# Altium schematic sheet Debug.SchDoc
size A; SheetNumber: 4; SheetTotal: 5
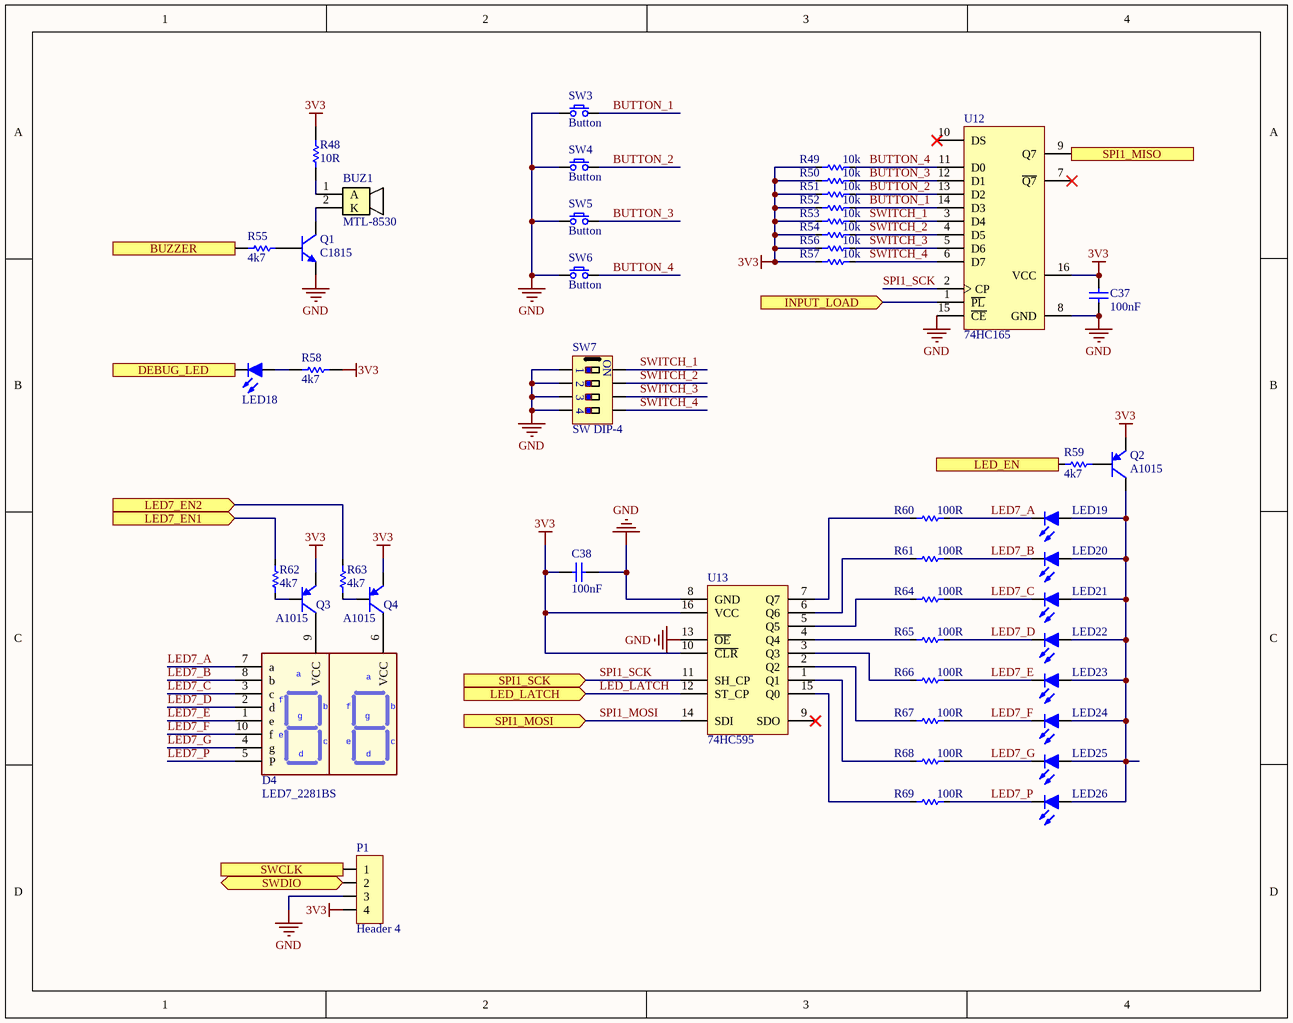
[diagram p0: Debug.SchDoc]

## Parts
BUZ1  MTL-8530  [MLT-8530]
C37  100nF  [C 0603 (1608)]
C38  100nF  [C 0603 (1608)]
D4  LED7_2281BS  [LED7 2281]
LED18  Led-Red  [Led SMD 0603 RED]  (value not drawn)
LED19  Led-Red  [Led SMD 0603 RED]  (value not drawn)
LED20  Led-Red  [Led SMD 0603 RED]  (value not drawn)
LED21  Led-Red  [Led SMD 0603 RED]  (value not drawn)
LED22  Led-Red  [Led SMD 0603 RED]  (value not drawn)
LED23  Led-Red  [Led SMD 0603 RED]  (value not drawn)
LED24  Led-Red  [Led SMD 0603 RED]  (value not drawn)
LED25  Led-Red  [Led SMD 0603 RED]  (value not drawn)
LED26  Led-Red  [Led SMD 0603 RED]  (value not drawn)
P1  Header 4  [Header 4]
Q1  C1815  [SOT-23]
Q2  A1015  [SOT-23]
Q3  A1015  [SOT-23]
Q4  A1015  [SOT-23]
R48  10R  [R 0603 (1608)]
R49  10k  [R 0603 (1608)]
R50  10k  [R 0603 (1608)]
R51  10k  [R 0603 (1608)]
R52  10k  [R 0603 (1608)]
R53  10k  [R 0603 (1608)]
R54  10k  [R 0603 (1608)]
R55  4k7  [R 0603 (1608)]
R56  10k  [R 0603 (1608)]
R57  10k  [R 0603 (1608)]
R58  4k7  [R 0603 (1608)]
R59  4k7  [R 0603 (1608)]
R60  100R  [R 0603 (1608)]
R61  100R  [R 0603 (1608)]
R62  4k7  [R 0603 (1608)]
R63  4k7  [R 0603 (1608)]
R64  100R  [R 0603 (1608)]
R65  100R  [R 0603 (1608)]
R66  100R  [R 0603 (1608)]
R67  100R  [R 0603 (1608)]
R68  100R  [R 0603 (1608)]
R69  100R  [R 0603 (1608)]
SW3  Button  [SW/2/SMD - 6X6X5]
SW4  Button  [SW/2/SMD - 6X6X5]
SW5  Button  [SW/2/SMD - 6X6X5]
SW6  Button  [SW/2/SMD - 6X6X5]
SW7  SW DIP-4  [SW/DIP4]
U12  74HC165  [TSSOP 16 65P]
U13  74HC595  [TSSOP 16 65P]

## Ports
BUZZER (in), DEBUG_LED (in), INPUT_LOAD (in), LED7_EN1 (in), LED7_EN2 (in), LED_EN (in), LED_LATCH (in), SPI1_MISO (out), SPI1_MOSI (in), SPI1_SCK (in), SWCLK (out), SWDIO (bidir)

## Nets
3V3: C37.1 C38.1 P1.4 Q2.2(E) Q3.2(E) Q4.2(E) R48.2 R49.1 R50.1 R51.1 R52.1 R53.1 R54.1 R56.1 R57.1 R58.2 U12.16(VCC) U13.10(~{CLR}) U13.16(VCC)
GND: C37.2 C38.2 P1.3 Q1.2(E) SW3.1 SW4.1 SW5.1 SW6.1 SW7.1 SW7.2 SW7.3 SW7.4 U12.8(GND) U12.15(~{CE}) U13.8(GND) U13.13(~{OE})
BUTTON_1: R52.2 SW3.2 U12.14(D3)
BUTTON_2: R51.2 SW4.2 U12.13(D2)
BUTTON_3: R50.2 SW5.2 U12.12(D1)
BUTTON_4: R49.2 SW6.2 U12.11(D0)
BUZZER: R55.1 ; port BUZZER
DEBUG_LED: LED18.2(K) ; port DEBUG_LED
INPUT_LOAD: U12.1(~{PL}) ; port INPUT_LOAD
LED7_A: D4.7(a) LED19.2(K) R60.2
LED7_B: D4.8(b) LED20.2(K) R61.2
LED7_C: D4.3(c) LED21.2(K) R64.2
LED7_D: D4.2(d) LED22.2(K) R65.2
LED7_E: D4.1(e) LED23.2(K) R66.2
LED7_EN1: R62.2 ; port LED7_EN1
LED7_EN2: R63.2 ; port LED7_EN2
LED7_F: D4.10(f) LED24.2(K) R67.2
LED7_G: D4.4(g) LED25.2(K) R68.2
LED7_P: D4.5(P) LED26.2(K) R69.2
LED_EN: R59.2 ; port LED_EN
LED_LATCH: U13.12(ST_CP) ; port LED_LATCH
SPI1_MISO: U12.9(Q7) ; port SPI1_MISO
SPI1_MOSI: U13.14(SDI) ; port SPI1_MOSI
SPI1_SCK: U12.2(CP) U13.11(SH_CP) ; port SPI1_SCK
SWCLK: P1.1 ; port SWCLK
SWDIO: P1.2 ; port SWDIO
SWITCH_1: R53.2 SW7.8 U12.3(D4)
SWITCH_2: R54.2 SW7.7 U12.4(D5)
SWITCH_3: R56.2 SW7.6 U12.5(D6)
SWITCH_4: R57.2 SW7.5 U12.6(D7)
NetBUZ1_1: BUZ1.1(A) R48.1
NetBUZ1_2: BUZ1.2(K) Q1.3(C)
NetD4_6: D4.6(VCC) Q4.3(C)
NetD4_9: D4.9(VCC) Q3.3(C)
NetLED18_1: LED18.1(A) R58.1
NetLED19_1: LED19.1(A) LED20.1(A) LED21.1(A) LED22.1(A) LED23.1(A) LED24.1(A) LED25.1(A) LED26.1(A) Q2.3(C)
NetQ1_1: Q1.1(B) R55.2
NetQ2_1: Q2.1(B) R59.1
NetQ3_1: Q3.1(B) R62.1
NetQ4_1: Q4.1(B) R63.1
NetR60_1: R60.1 U13.7(Q7)
NetR61_1: R61.1 U13.6(Q6)
NetR64_1: R64.1 U13.5(Q5)
NetR65_1: R65.1 U13.4(Q4)
NetR66_1: R66.1 U13.3(Q3)
NetR67_1: R67.1 U13.2(Q2)
NetR68_1: R68.1 U13.1(Q1)
NetR69_1: R69.1 U13.15(Q0)

Not connected (* = marked no-connect by the designer): U12 7(~{Q7})* 10(DS)*; U13 9(SDO)*

## Notes on the sheet
- (in symbol SW DIP-4) ON

## Library data of the parts
BUZ1 = Buzzer
C37 C38 = Capacitor NP: Capacitor non-pol
LED18-LED26 = Led: Typical LED
P1 = Header 4: Header, 4-Pin
Q1 = Transistor NPN: NPN Bipolar Transistor
Q2-Q4 = Transistor PNP: PNP Bipolar Transistor; Published: 8-Jun-2000; LatestRevisionDate: 29-May-2009; LatestRevisionNote: IPC-7351 Footprint Added.; PackageVersion: Aug-1999; PackageReference: SOT-23B; Publisher: Altium Limited; PackageDescription: 3-Pin SOT-23 Package 0.95 mm Pitch, 2.4 mm Lead Span
R48-R69 = Resistor: Published: 8-Jun-2000; LatestRevisionDate: 17-Jul-2002; LatestRevisionNote: Re-released for DXP Platform.; PackageReference: AXIAL-0.3; Publisher: Altium Limited
SW3-SW6 = SW SPST: Tact switch 2 pin
U12 = 74HC165: 8-bit serial-in, serial or parallel-out  shift register with output latches;  3-state
U13 = 74HC595: 8-bit serial-in, serial or parallel-out  shift register with output latches;  3-state